# EAGLE design SparkFun-XBee-Serial-Explorer-v12 (EAGLE 7.1.0)
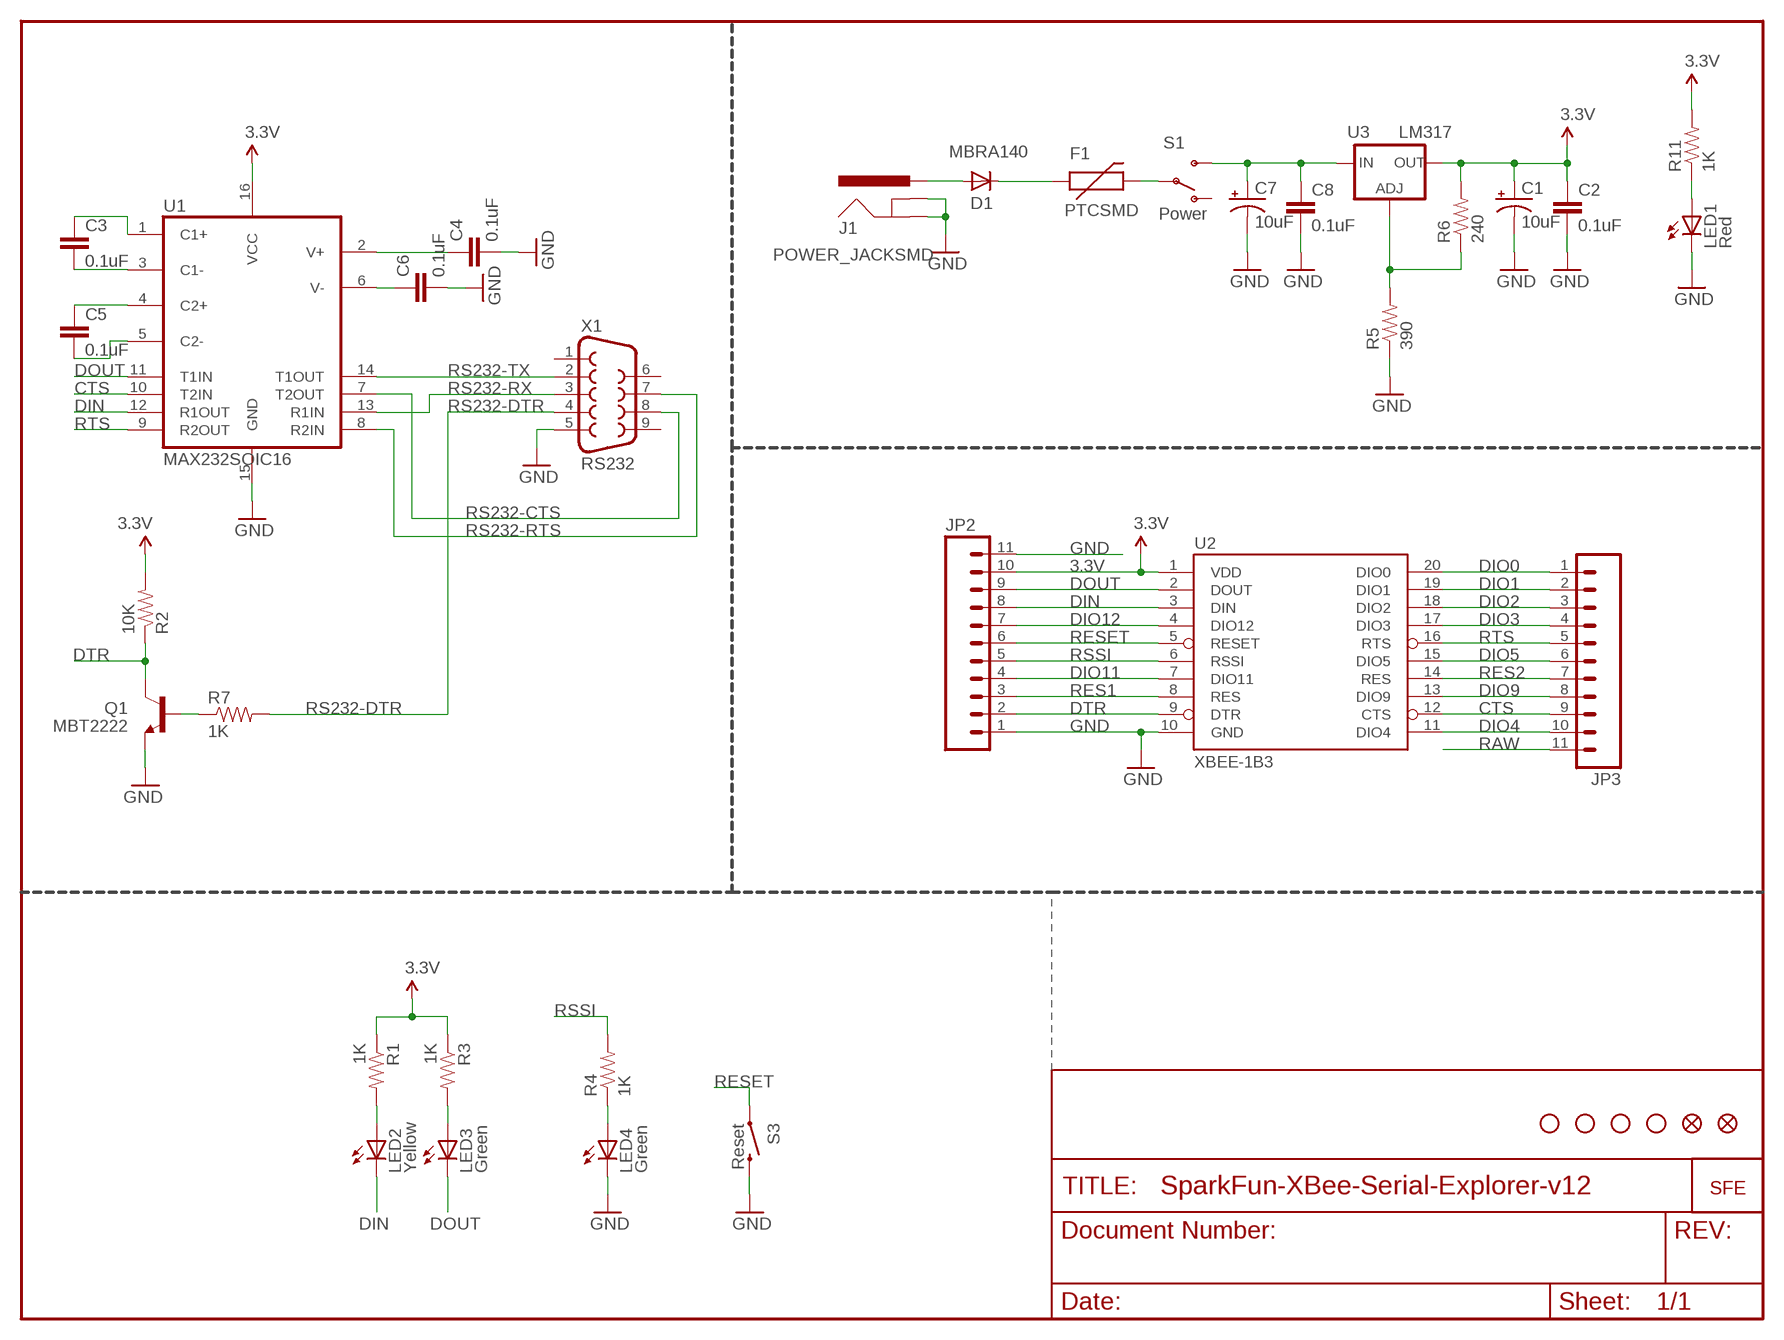
[diagram p0: schematic, sheet 1]

## Parts
C1  10uF  CAP_POL1206  [EIA3216]
C2  0.1uF  CAP0402  [C0402]
C3  0.1uF  CAP0402  [C0402]
C4  0.1uF  CAP0402  [C0402]
C5  0.1uF  CAP0402  [C0402]
C6  0.1uF  CAP0402  [C0402]
C7  10uF  CAP_POL1206  [EIA3216]
C8  0.1uF  CAP0402  [C0402]
D1  MBRA140  DIODESMA  [SMA-DIODE]
F1  PTCSMD  [PTC-1206]
J1  POWER_JACKSMD  [POWER_JACK_SMD]
JP2  M11PTH  [1X11]
JP3  M11PTH  [1X11]
LED1  Red  LED1206  [LED-1206]
LED2  Yellow  LED1206  [LED-1206]
LED3  Green  LED1206  [LED-1206]
LED4  Green  LED1206  [LED-1206]
Q1  MBT2222  TRANSISTOR_NPNSOT23-3  [SOT23-3]
R1  1K  RESISTOR0402  [C0402]
R2  10K  RESISTOR0402  [C0402]
R3  1K  RESISTOR0402  [C0402]
R4  1K  RESISTOR0402  [C0402]
R5  390  RESISTOR0402  [C0402]
R6  240  RESISTOR0402  [C0402]
R7  1K  RESISTOR0402  [C0402]
R11  1K  RESISTOR0402  [C0402]
S1  Power  SWITCH-SPSTSMD  [AYZ0202]
S3  Reset  SWITCH-MOMENTARY-2SMD  [TACTILE_SWITCH_SMD]
U1  MAX232SOIC16  [SO016]
U2  XBEE-1B3  [XBEE-SMD]
U3  LM317  V_REG_317SMD  [SOT223]
U$4  LOGO-SFENEW  [SFE-NEW-WEBLOGO]
U$5  STAND-OFF  [STAND-OFF]
U$7  FIDUCIAL1X2  [FIDUCIAL-1X2]
U$9  STAND-OFF  [STAND-OFF]
U$10  STAND-OFF  [STAND-OFF]
U$11  STAND-OFF  [STAND-OFF]
U$16  FIDUCIAL1X2  [FIDUCIAL-1X2]
X1  RS232  DB9  [DB9]

## Nets
3.3V [vcc]: C1.A(+) C2.1 JP2.10 R1.1 R2.2 R3.1 R6.2 R11.2 U1.16(VCC) U2.1(VDD) U3.2(OUT)
CTS: JP3.9 U1.10(T2IN) U2.12(CTS)
DIN: JP2.8 LED2.C U1.12(R1OUT) U2.3(DIN)
DIO0: JP3.1 U2.20(DIO0)
DIO1: JP3.2 U2.19(DIO1)
DIO2: JP3.3 U2.18(DIO2)
DIO3: JP3.4 U2.17(DIO3)
DIO4: JP3.10 U2.11(DIO4)
DIO5: JP3.6 U2.15(DIO5)
DIO9: JP3.8 U2.13(DIO9)
DIO11: JP2.4 U2.7(DIO11)
DIO12: JP2.7 U2.4(DIO12)
DOUT: JP2.9 LED3.C U1.11(T1IN) U2.2(DOUT)
DTR: JP2.2 Q1.3(C) R2.1 U2.9(DTR)
GND [vcc]: C1.C(-) C2.2 C4.2 C6.2 C7.C(-) C8.2 J1.GND(GNDBREAK) J1.P$4(GND) JP2.1 JP2.11 LED1.C LED4.C Q1.2(E) R5.1 S3.3 U1.15(GND) U2.10(GND) X1.5
N$1: LED2.A R1.2
N$2: LED4.A R4.1
N$3: C3.1 U1.1(C1+)
N$4: LED3.A R3.2
N$5: C3.2 U1.3(C1-)
N$6: C5.1 U1.4(C2+)
N$7: C5.2 U1.5(C2-)
N$8: C6.1 U1.6(V-)
N$9: C4.1 U1.2(V+)
N$10: R5.2 R6.1 U3.1(ADJ)
N$11: F1.2 S1.2(P)
N$12: Q1.1(B) R7.1
N$15: D1.A J1.VIN0(PWR)
N$16: D1.C F1.1
N$38: LED1.A R11.1
RAW [vcc]: C7.A(+) C8.1 JP3.11 S1.3(S) U3.3(IN)
RES1: JP2.3 U2.8(RES)
RES2: JP3.7 U2.14(RES)
RESET: JP2.6 S3.1 U2.5(RESET)
RS232-CTS: U1.7(T2OUT) X1.8
RS232-DTR: R7.2 X1.4
RS232-RTS: U1.8(R2IN) X1.7
RS232-RX: U1.13(R1IN) X1.3
RS232-TX: U1.14(T1OUT) X1.2
RSSI: JP2.5 R4.2 U2.6(RSSI)
RTS: JP3.5 U1.9(R2OUT) U2.16(RTS)
Unconnected: S1.1(O) X1.1 X1.6 X1.9

## Library data of the parts
C1 C7 = SparkFun:CAP_POL: Capacitor Polarized These are standard SMD and PTH capacitors. Normally 10uF, 47uF, and 100uF in electrolytic and tantalum varieties. Always verify the external diameter of the through hole cap, it varies with capacity, voltage, and manufacturer. The EIA devices should be standard.
C2-C6 C8 = SparkFun:CAP: Capacitor Standard 0603 ceramic capacitor, and 0.1" leaded capacitor.
D1 = SparkFun:DIODE: Diode These are standard reverse protection diodes and small signal diodes. SMA package can handle up to about 1A. SOD-323 can handle about 200mA. What the SOD-323 package when ordering, there are some mfgs out there that are 5-pin packages.
F1 = SparkFun:PTC: Resettable Fuse PTC Resettable Fuse. Spark Fun Electronics SKU : COM-08357
J1 = SparkFun:POWER_JACK: Power Jack This is the standard 5.5mm barrel jack for power. The PTH is the most common, proven, reliable, footprint. All others are experimental. The Slot footprint only works if the mill layer is transmitted to the PCB fab house so be warned. Spark Fun Electronics SKU : PRT-00119. Mating wall wart : TOL-00298 (and others)
JP2 JP3 = SparkFun:M11: Header 11 Standard 11-pin 0.1" header. Use with straight break away headers (SKU : PRT-00116), right angle break away headers (PRT-00553), swiss pins (PRT-00743), machine pins (PRT-00117), and female headers (PRT-00115).
LED1-LED4 = SparkFun:LED: LEDs Standard schematic elements and footprints for 5mm, 3mm, 1206, and 0603 sized LEDs. 5mm - Spark Fun Electronics SKU : COM-00529 (and others)
Q1 = SparkFun:TRANSISTOR_NPN: Transistor NPN BJT configuration in SOT23 package. MMBT2222 is the common NPN we use. Double check BCE configuration again layout.
R1-R7 R11 = SparkFun:RESISTOR: Resistor Basic schematic elements and footprints for 0603, 1206, and PTH 1/10th watt (small) resistors.
S1 = SparkFun:SWITCH-SPST: SPST Switch Simple slide switch. Spark Fun Electronics SKU : COM-00102
S3 = SparkFun:SWITCH-MOMENTARY-2
U1 = SparkFun:MAX232: RS232 Transceiver Very common IC. This is generically called 'MAX232', but works with the 3V equivalent MAX3232 generic ICs. Field tested and mother approved. Spark Fun Electronics SKU : COM-00316 (DIP) and COM-00589 (SMD)
U2 = SparkFun:XBEE-1
U3 = SparkFun:V_REG_317: Voltage Regulator Standard LM317 adjustable voltage regulator. AOI (Adjust Output Input). Google 'LM317 Calculator' for easy to use app to get the two resistor values needed. 240/720 for 5V output. 240/390 for 3.3V output. Spark Fun Electronics SKU : COM-00527
U$4 = SparkFun:LOGO-SFE: Spark Fun Electronics PCB Logo This is the standard Spark Fun Electronics PCB logo.
U$5 U$9-U$11 = SparkFun:STAND-OFF: Stand Off This is the mechanical footprint for a #4 phillips button head screw. Use the keepout ring to avoid running the screw head into surrounding components. SKU : PRT-00447
U$7 U$16 = SparkFun:FIDUCIAL: Fiducial Alignment Points Various fiducial points for machine vision alignment.
X1 = SparkFun:DB9: DB9 Connector Standard DB9 (D-Sub 9) serial connector. Can be used for CAN bus as well as RS485 and RS232. Footprint production proven. Spark Fun Electronics SKU : PRT-00429

## Net classes
0 default: width 0.203 mm
1 vcc: width 0.305 mm
2 gnd: width 0.254 mm

## Board
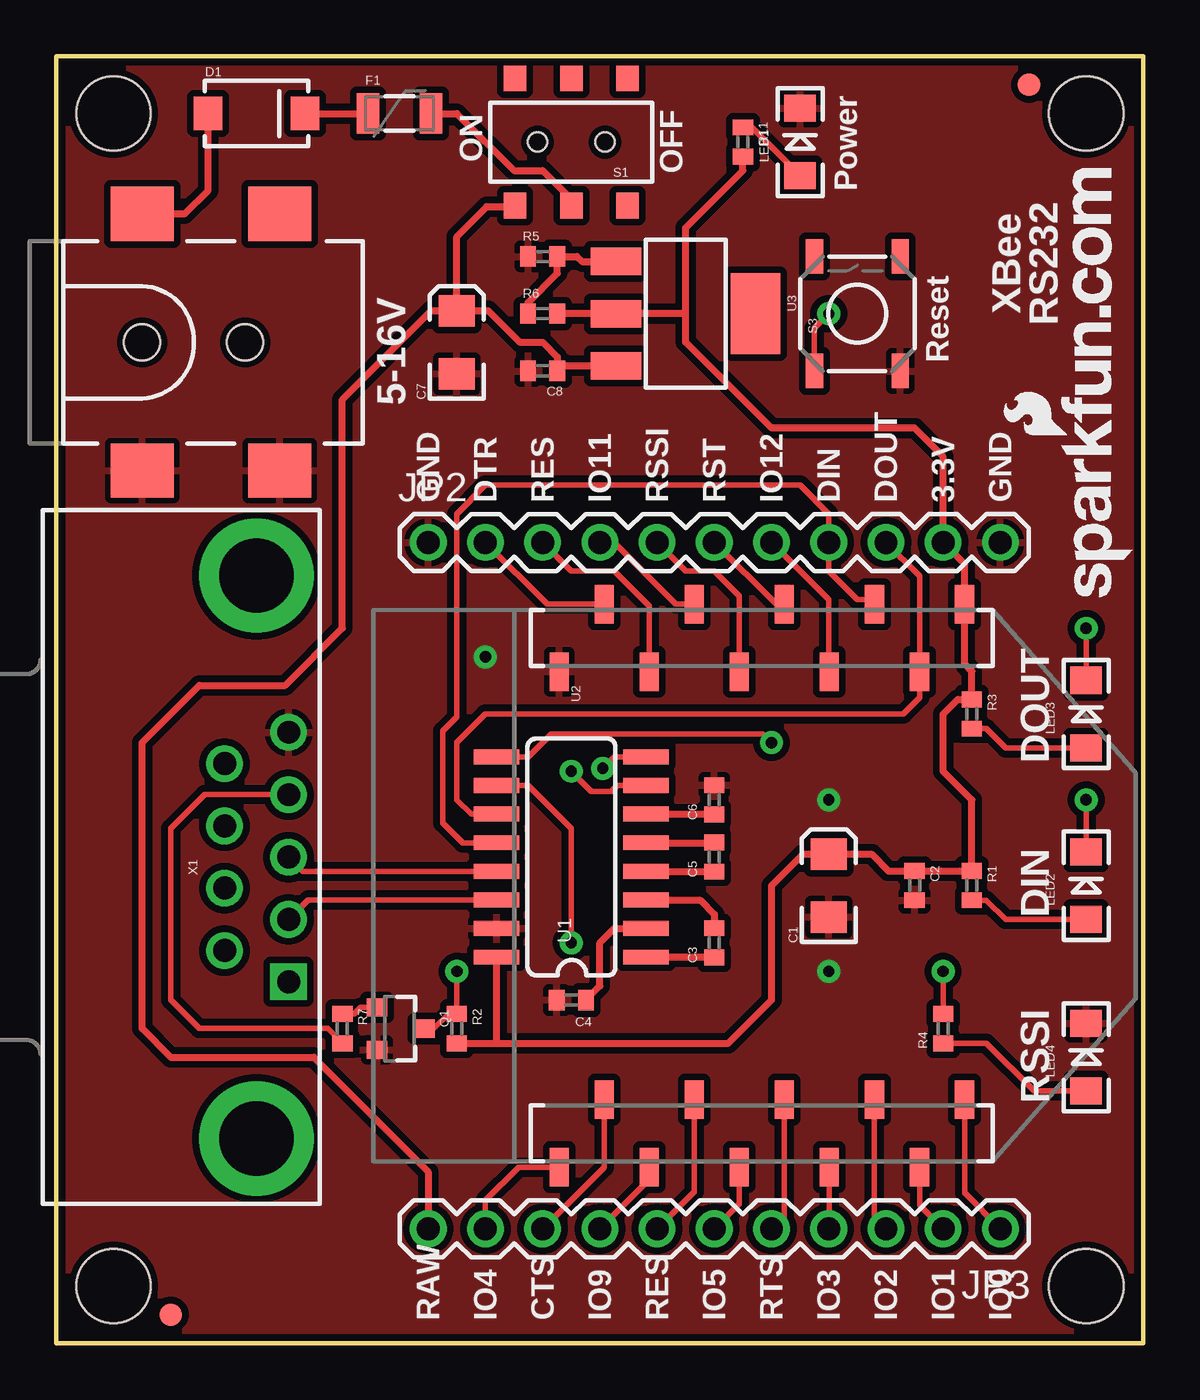
[diagram p1: board, top side]
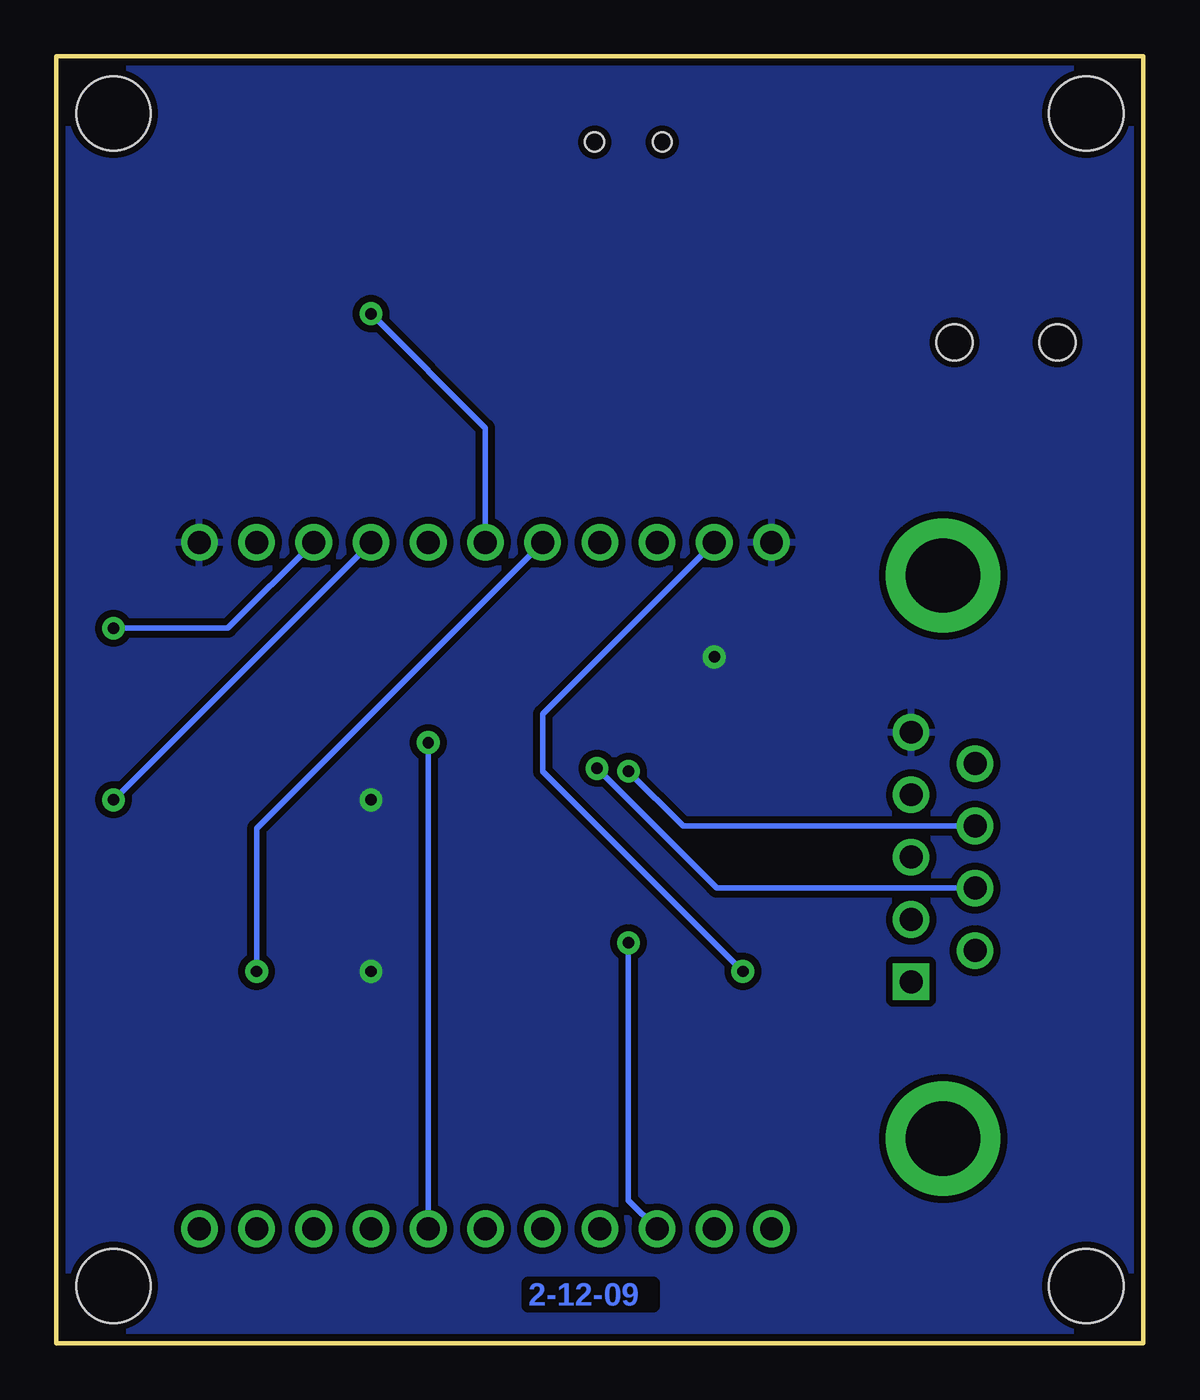
[diagram p2: board, bottom side, seen from below]

Size 48.26 x 57.15 mm. Coordinates in mm from the lower left corner, seen from the top.
Outline: 0,0 48.26,0 48.26,57.15 0,57.15 0,0
Copper layers (1*16): Top 0.035mm / dielectric 1.5mm / Bottom 0.035mm
Design rules "SparkFun": minimum track width 8mil, minimum drill 20mil, track to track 8mil, track to pad 8mil, pad to pad 8mil, via to via 8mil, smd to smd 8mil, copper to edge 10mil, drill to drill 8mil, minimum pad ring 12mil, minimum via ring 10mil, stop-mask expansion 4mil, vias tented up to drill 25mil, thermal gap 10mil

### Footprints (pad centres in the part's own frame; a part is rotated, then mirrored left to right if it is on the bottom)
EIA3216 = smd 1.4 x 1.6: A 1.4,0; C -1.4,0
C0402 = smd 0.7 x 0.9: 1 -0.65,0; 2 0.65,0
SMA-DIODE = smd 1.27 x 1.47: A -2.15,0; C 2.15,0
PTC-1206 = smd 1 x 1.8: 1 -1.4,0; 2 1.4,0
POWER_JACK_SMD = smd 2.8 x 2.4: GND 0,-5.7; P$4 6.1,-5.7; VIN0 0,5.7; VIN1 6.1,5.7 | hole 1.6: 0,0; 4.572,0
1X11 = drill 1.016: 1 0,0; 2 2.54,0; 3 5.08,0; 4 7.62,0; 5 10.16,0; 6 12.7,0; 7 15.24,0; 8 17.78,0; 9 20.32,0; 10 22.86,0; 11 25.4,0
LED-1206 = smd 1.2 x 1.4: A -1.5,0; C 1.5,0
SOT23-3 = smd 0.8 x 0.9: 1 -0.95,-1; 2 0.95,-1; 3 0,1.1
AYZ0202 = smd 1 x 1.15: 1 -2.5,2.825; 2 0,2.825; 3 2.5,2.825; 4 -2.5,-2.825; 5 0,-2.825; 6 2.5,-2.825 | hole 0.85: 1.5,0; -1.5,0
TACTILE_SWITCH_SMD = smd 1.524 x 0.762: 1 -2.54,1.905; 2 2.54,1.905; 3 -2.54,-1.905; 4 2.54,-1.905
SO016 = smd 0.66 x 2.032: 1 -4.445,-3.315; 2 -3.175,-3.315; 3 -1.905,-3.315; 4 -0.635,-3.315; 5 0.635,-3.315; 6 1.905,-3.315; 7 3.175,-3.315; 8 4.445,-3.315; 9 4.445,3.315; 10 3.175,3.315; 11 1.905,3.315; 12 0.635,3.315; 13 -0.635,3.315; 14 -1.905,3.315; 15 -3.175,3.315; 16 -4.445,3.315
XBEE-SMD = smd 1.7 x 0.85: 1 -12.5,20; 2 -9.5,18; 3 -12.5,16; 4 -9.5,14; 5 -12.5,12; 6 -9.5,10; 7 -12.5,8; 8 -9.5,6; 9 -12.5,4; 10 -9.5,2; 11 12.5,2; 12 9.5,4; 13 12.5,6; 14 9.5,8; 15 12.5,10; 16 9.5,12; 17 12.5,14; 18 9.5,16; 19 12.5,18; 20 9.5,20
SOT223 = smd 1.219 x 2.235: 1 -2.311,-3.099; 2 0,-3.099; 3 2.311,-3.099 | smd 3.6 x 2.2: 4 0,3.099
STAND-OFF = hole 3.302: 0,0
FIDUCIAL-1X2 = smd 1 x 1: 1 0,0
DB9 = drill 1.016 square: 1 -5.54,-1.42 | drill 1.016: 2 -2.77,-1.42; 3 0,-1.42; 4 2.77,-1.42; 5 5.54,-1.42; 6 -4.15,1.42; 7 -1.38,1.42; 8 1.38,1.42; 9 4.15,1.42 | drill 3.302 pad 5.08: G1 -12.5,0; G2 12.5,0

### Placement (x,y rotation side)
C1  34.29,20.32 90 top
C2  38.1,20.32 270 top
C3  29.21,17.78 90 top
C4  22.86,15.24 180 top
C5  29.21,21.59 90 top
C6  29.21,24.13 90 top
C7  17.78,44.45 90 top
C8  21.59,43.18 180 top
D1  8.89,54.61 0 top
F1  15.24,54.61 0 top
J1  3.81,44.45 0 top
JP2  16.51,35.56 0 top
JP3  41.91,5.08 180 top
LED1  33.02,53.34 90 top
LED2  45.72,20.32 90 top
LED3  45.72,27.94 90 top
LED4  45.72,12.7 90 top
Q1  15.24,13.97 270 top
R1  40.64,20.32 270 top
R2  17.78,13.97 270 top
R3  40.64,27.94 270 top
R4  39.37,13.97 90 top
R5  21.59,48.26 0 top
R6  21.59,45.72 0 top
R7  12.7,13.97 270 top
R11  30.48,53.34 270 top
S1  22.86,53.34 180 top
S3  35.56,45.72 90 top
U1  22.86,21.59 90 top
U2  20.32,20.32 270 top
U3  27.94,45.72 270 top
U$4  47.75,33.15 90 top
U$5  45.72,2.54 0 top
U$7  5.08,1.27 0 top
U$9  45.72,54.61 0 top
U$10  2.54,54.61 0 top
U$11  2.54,2.54 0 top
U$16  43.18,55.88 0 top
X1  8.89,21.59 90 top

### Tracks (layer width: path | path; a pad name or v marks a point on that pad's centre or on a via)
3.3V
  Top 0.305: U1.16 19.55,13.33 19.56,13.32 | R11.2 30.48,52.07 27.94,49.53 27.94,45.72 | 27.94,45.72 27.94,44.45 31.75,40.64 38.1,40.64 39.37,39.37 JP2.10 40.32,34.61 U2.1 40.32,30.16 40.64,29.84 R3.1 40.02,28.59 39.37,27.94 39.37,25.4 40.64,24.13 R1.1 C2.1 36.94,20.97 36.19,21.72 C1.A 33.15,21.72 31.75,20.32 31.75,15.24 29.83,13.32 19.56,13.32 | 27.94,45.72 U3.2 R6.2 | R2.2 19.56,13.32
CTS  (via drill 0.51)
  Top 0.254: U1.10 20.95,24.77 22.86,22.86 v22.86,17.78 | U2.12 24.32,7.81 JP3.9
  Bottom 0.254: v22.86,17.78 22.86,6.35 JP3.9
DIN  (via drill 0.51)
  Top 0.254: U2.3 36.32,33.02 35.56,33.02 34.29,34.29 JP2.8 34.29,36.83 33.02,38.1 19.05,38.1 17.78,36.83 17.78,27.81 17.14,27.18 17.14,23.11 18.03,22.23 U1.12 19.68,22.35 | v45.72,24.13 LED2.C
  Bottom 0.254: JP2.8 v45.72,24.13
DIO0
  Top 0.254: U2.20 40.32,6.67 JP3.1
DIO1
  Top 0.254: U2.19 38.32,6.13 JP3.2
DIO2
  Top 0.254: U2.18 36.32,5.59 JP3.3
DIO3
  Top 0.254: U2.17 34.32,5.11 JP3.4
DIO4
  Top 0.254: U2.11 20.52,7.82 19.05,6.35 JP3.10
DIO5
  Top 0.254: U2.15 30.32,6.19 JP3.6
DIO9
  Top 0.254: U2.13 26.32,7.27 JP3.8
DIO11
  Top 0.254: JP2.4 24.77,35.56 27.5,32.82 U2.7
DIO12
  Top 0.254: JP2.7 34.29,33.02 34.29,29.21 34.32,29.24 U2.4
DOUT  (via drill 0.51)
  Top 0.254: JP2.9 38.32,34.07 U2.2 38.32,28.67 37.59,27.94 19.05,27.94 17.78,26.67 17.78,24.13 18.41,23.5 U1.11 | v45.72,31.75 LED3.C
  Bottom 0.254: v45.72,31.75 40.64,31.75 JP2.9
DTR  (via drill 0.51)
  Top 0.254: U2.9 21.79,32.82 JP2.2 | Q1.3 16.76,13.97 17.41,14.62 R2.1 v17.78,16.51
  Bottom 0.254: v17.78,16.51 26.67,25.4 26.67,27.94 JP2.2
GND  (via drill 0.51)
  other vias: 19.05,30.48 34.29,24.13 34.29,16.51
  pour Bottom (isolate 0.305): 0,57.15 48.26,57.15 48.26,0 0,0
  pour Top (isolate 0.305): 0,57.15 48.26,57.15 48.26,0 0,0
N$1
  Top 0.254: R1.2 41.29,19.67 42.14,18.82 LED2.A
N$2
  Top 0.254: LED4.A 43.41,11.2 41.29,13.32 R4.1
N$3
  Top 0.305: U1.1 29.2,17.14 C3.1
N$4
  Top 0.254: LED3.A 42.14,26.44 41.29,27.29 R3.2
N$5
  Top 0.305: U1.3 28.57,19.68 29.21,19.05 C3.2
N$6
  Top 0.305: U1.4 29.2,20.95 C5.1
N$7
  Top 0.305: U1.5 29.2,22.23 C5.2
N$8
  Top 0.305: U1.6 29.2,23.5 C6.1
N$9
  Top 0.305: U1.2 24.77,18.41 24.13,17.78 24.13,15.86 C4.1
N$10
  Top 0.305: U3.1 23.34,48.03 23.11,48.26 R5.2 22.24,47.51 20.94,46.21 R6.1
N$11
  Top 0.305: S1.2 22.86,50.8 21.59,52.07 20.32,52.07 17.78,54.61 F1.2
N$12
  Top 0.254: R7.1 13.22,14.62 13.52,14.92 Q1.1
N$15
  Top 0.305: D1.A 6.74,51.19 5.7,50.15 J1.VIN0
N$16
  Top 0.305: D1.C F1.1
N$38
  Top 0.254: R11.1 30.87,53.99 LED1.A
RAW
  Top 0.305: S1.3 20.32,50.48 19.11,50.48 17.78,49.15 C7.A | C7.A 16.64,45.85 12.7,41.91 12.7,31.75 10.16,29.21 6.35,29.21 3.81,26.67 3.81,13.97 5.08,12.7 11.43,12.7 16.51,7.62 JP3.11 | U3.3 22.47,43.41 C8.1 22.24,43.8 21.59,44.45 20.57,44.45 19.18,45.85 C7.A
RES1
  Top 0.254: U2.8 26.32,32.73 24.77,34.29 22.86,34.29 JP2.3
RES2
  Top 0.254: U2.14 28.32,6.73 JP3.7
RESET  (via drill 0.51)
  Top 0.254: U2.5 31.95,32.82 JP2.6 | S3.1 33.66,45.09 v34.29,45.72
  Bottom 0.254: JP2.6 29.21,40.64 v34.29,45.72
RS232-CTS  (via drill 0.51)
  Top 0.254: U1.7 24.89,24.77 24.64,24.51 23.75,24.51 v22.86,25.4
  Bottom 0.254: X1.8 20.43,22.97 v22.86,25.4
RS232-DTR
  Top 0.254: X1.4 6.58,24.36 5.08,22.86 5.08,15.24 6.35,13.97 12.05,13.97 R7.2
RS232-RTS  (via drill 0.51)
  Top 0.254: U1.8 24.77,26.04 v24.26,25.53
  Bottom 0.254: v24.26,25.53 19.05,20.32 18.94,20.21 X1.7
RS232-RX
  Top 0.254: U1.13 10.95,20.95 X1.3
RS232-TX
  Top 0.254: U1.14 11.18,19.68 X1.2
RSSI  (via drill 0.51)
  Top 0.254: R4.2 v39.37,16.51 | U2.6 30.32,33.18 29.21,34.29 27.94,34.29 JP2.5
  Bottom 0.254: v39.37,16.51 39.37,22.86 JP2.5
RTS  (via drill 0.51)
  Top 0.254: JP3.5 32.32,5.65 U2.16 32.49,10.82 32.51,10.79 | U1.9 20.95,26.04 21.97,27.05 31.37,27.05 v31.75,26.67
  Bottom 0.254: JP3.5 v31.75,26.67

### Text on the board
Bottom: 2-12-09
tPlace: ON | OFF | Power | XBee | RS232 | Reset | 5-16V | GND | DTR | RES | IO11 | RSSI | RST | IO12 | DIN | DOUT | 3.3V | GND | DOUT | DIN | RSSI | RAW | IO4 | CTS | IO9 | RES | IO5 | RTS | IO3 | IO2 | IO1 | IO0